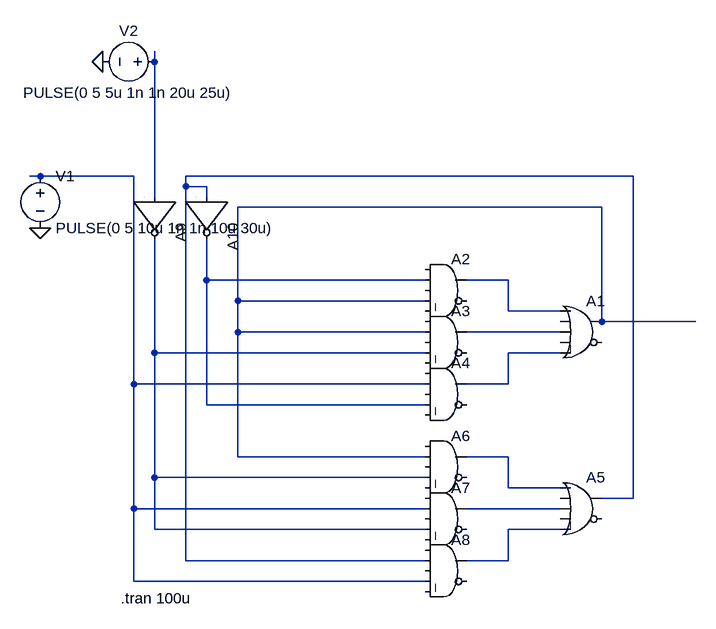
[diagram p0: schematic Type_II_Phase_comparator.asc]
Type_II_Phase_comparator.asc, the LTspice schematic file:
Version 4
SHEET 1 880 680
WIRE -272 -304 -272 -320
WIRE -448 -128 -464 -128
WIRE -304 -128 -448 -128
WIRE 464 -128 -224 -128
WIRE -224 -112 -224 -128
WIRE -192 -112 -224 -112
WIRE -272 -96 -272 -304
WIRE -192 -96 -192 -112
WIRE 416 -80 -144 -80
WIRE -192 32 -192 -32
WIRE 144 32 -192 32
WIRE 272 32 208 32
WIRE -144 64 -144 -80
WIRE 144 64 -144 64
WIRE 272 80 272 32
WIRE 352 80 272 80
WIRE 416 96 416 -80
WIRE 560 96 416 96
WIRE -144 112 -144 64
WIRE 144 112 -144 112
WIRE 352 112 208 112
WIRE -272 144 -272 -32
WIRE 144 144 -272 144
WIRE 352 144 272 144
WIRE -304 192 -304 -128
WIRE 144 192 -304 192
WIRE 272 192 272 144
WIRE 272 192 208 192
WIRE -192 224 -192 32
WIRE 144 224 -192 224
WIRE -144 304 -144 112
WIRE 144 304 -144 304
WIRE 272 304 208 304
WIRE -272 336 -272 144
WIRE 144 336 -272 336
WIRE 272 352 272 304
WIRE 352 352 272 352
WIRE 464 368 464 -128
WIRE 464 368 416 368
WIRE -304 384 -304 192
WIRE 144 384 -304 384
WIRE 352 384 208 384
WIRE -272 416 -272 336
WIRE 144 416 -272 416
WIRE 352 416 272 416
WIRE -224 464 -224 -112
WIRE 144 464 -224 464
WIRE 272 464 272 416
WIRE 272 464 208 464
WIRE -304 496 -304 384
WIRE 144 496 -304 496
FLAG -352 -304 0
FLAG -448 -48 0
SYMBOL Digital\\or 384 48 R0
SYMATTR InstName A1
SYMBOL Digital\\and 176 -16 R0
SYMATTR InstName A2
SYMBOL Digital\\and 176 64 R0
SYMATTR InstName A3
SYMBOL Digital\\and 176 144 R0
SYMATTR InstName A4
SYMBOL Digital\\or 384 320 R0
SYMATTR InstName A5
SYMBOL Digital\\and 176 256 R0
SYMATTR InstName A6
SYMBOL Digital\\and 176 336 R0
SYMATTR InstName A7
SYMBOL Digital\\and 176 416 R0
SYMATTR InstName A8
SYMBOL Digital\\inv -208 -96 R90
SYMATTR InstName A9
SYMBOL Digital\\inv -128 -96 R90
SYMATTR InstName A10
SYMBOL voltage -448 -144 R0
WINDOW 123 0 0 Left 0
WINDOW 39 0 0 Left 0
SYMATTR InstName V1
SYMATTR Value PULSE(0 5 10u 1n 1n 10u 30u)
SYMBOL voltage -256 -304 R90
WINDOW 0 -32 56 VBottom 2
WINDOW 3 32 56 VTop 2
WINDOW 123 0 0 Left 0
WINDOW 39 0 0 Left 0
SYMATTR InstName V2
SYMATTR Value PULSE(0 5 5u 1n 1n 20u 25u)
TEXT -324 522 Left 2 !.tran 100u

The netlist it stands for:
* Type_II_Phase_comparator.asc
A1 N006 0 N007 0 N009 0 N004 0 OR
A2 0 N005 0 N004 0 0 N006 0 AND
A3 0 N004 0 N008 0 0 N007 0 AND
A4 0 N002 0 N005 0 0 N009 0 AND
A5 N010 0 N011 0 N012 0 N003 0 OR
A6 0 N004 0 N008 0 0 N010 0 AND
A7 0 N002 0 N008 0 0 N011 0 AND
A8 0 N003 0 N002 0 0 N012 0 AND
A9 N001 0 0 0 0 N008 0 0 BUF
A10 N003 0 0 0 0 N005 0 0 BUF
V1 N002 0 PULSE(0 5 10u 1n 1n 10u 30u)
V2 N001 0 PULSE(0 5 5u 1n 1n 20u 25u)
.tran 100u
.backanno
.end